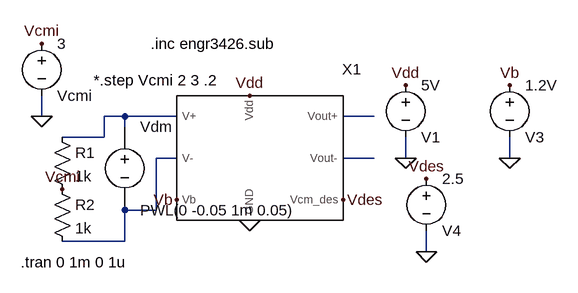
[diagram p0: schematic Draft1.asc]
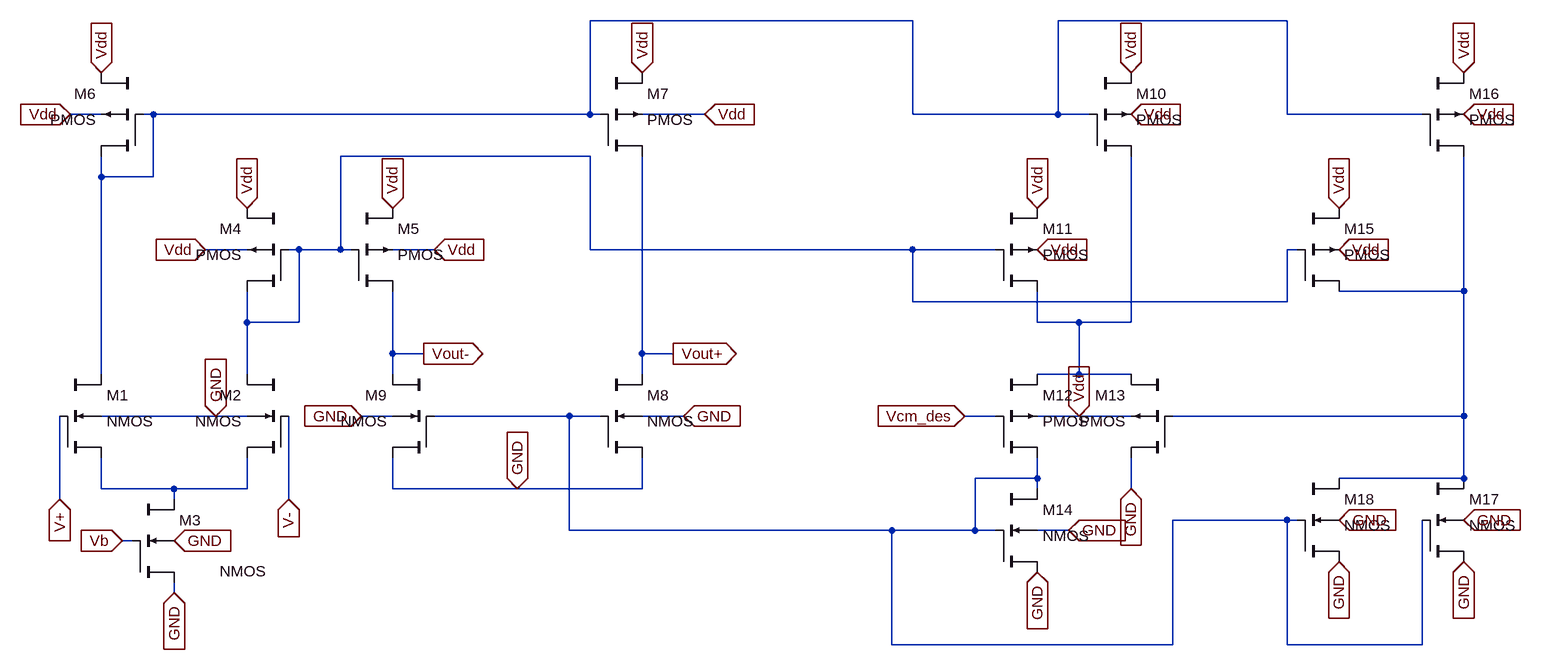
[diagram p1: sub-circuit cmfbdiffamp.asc]
Draft1.asc, the LTspice schematic file:
Version 4
SHEET 1 880 680
WIRE -176 112 -176 80
WIRE -48 112 -80 112
WIRE 32 112 -48 112
WIRE 336 112 288 112
WIRE -48 128 -48 112
WIRE -80 144 -80 112
WIRE -80 144 -144 144
WIRE 32 176 0 176
WIRE 336 176 288 176
WIRE 384 176 384 144
WIRE 544 176 544 144
WIRE 0 256 0 176
WIRE 0 256 -48 256
WIRE -48 304 -48 256
WIRE -48 304 -144 304
WIRE 416 320 416 288
FLAG 384 176 0
FLAG 384 64 Vdd
FLAG 544 64 Vb
FLAG 544 176 0
FLAG 144 80 Vdd
FLAG 144 272 0
FLAG 32 240 Vb
FLAG 416 320 0
FLAG 416 208 Vdes
FLAG 288 240 Vdes
FLAG -176 112 0
FLAG -176 0 Vcmi
FLAG -144 224 Vcmi
SYMBOL CMFBDiffAmp 144 176 R0
SYMATTR InstName X1
SYMBOL voltage 384 48 R0
WINDOW 0 24 96 Left 2
WINDOW 3 24 16 Left 2
WINDOW 123 0 0 Left 2
WINDOW 39 0 0 Left 2
SYMATTR InstName V1
SYMATTR Value 5V
SYMBOL voltage 544 48 R0
WINDOW 0 24 96 Left 2
WINDOW 3 24 16 Left 2
WINDOW 123 0 0 Left 2
WINDOW 39 0 0 Left 2
SYMATTR InstName V3
SYMATTR Value 1.2V
SYMBOL voltage 416 192 R0
WINDOW 0 24 96 Left 2
WINDOW 3 24 16 Left 2
WINDOW 123 0 0 Left 2
WINDOW 39 0 0 Left 2
SYMATTR InstName V4
SYMATTR Value 2.5
SYMBOL voltage -176 -16 R0
WINDOW 0 24 96 Left 2
WINDOW 3 24 16 Left 2
WINDOW 123 0 0 Left 2
WINDOW 39 0 0 Left 2
SYMATTR InstName Vcmi
SYMATTR Value 3
SYMBOL cktsym\\vsource -48 192 R0
WINDOW 39 0 0 Left 2
SYMATTR Value PWL(0 -0.05 1m 0.05)
SYMATTR InstName Vdm
SYMATTR Value2 AC 1 0
SYMBOL res -160 128 R0
SYMATTR InstName R1
SYMATTR Value 1k
SYMBOL res -160 208 R0
SYMATTR InstName R2
SYMATTR Value 1k
TEXT -208 336 Left 2 !.tran 0 1m 0 1u
TEXT -96 56 Left 2 !*.step Vcmi 2 3 .2
TEXT -8 0 Left 2 !.inc engr3426.sub

cmfbdiffamp.asc, the sub-circuit schematic file:
Version 4
SHEET 1 2344 680
WIRE 1376 -432 880 -432
WIRE 1952 -432 1600 -432
WIRE 128 -288 80 -288
WIRE 208 -288 192 -288
WIRE 880 -288 880 -432
WIRE 880 -288 208 -288
WIRE 896 -288 880 -288
WIRE 1056 -288 960 -288
WIRE 1376 -288 1376 -432
WIRE 1600 -288 1600 -432
WIRE 1600 -288 1376 -288
WIRE 1648 -288 1600 -288
WIRE 1952 -288 1952 -432
WIRE 2160 -288 1952 -288
WIRE 880 -224 496 -224
WIRE 128 -192 128 -224
WIRE 208 -192 208 -288
WIRE 208 -192 128 -192
WIRE 352 -80 288 -80
WIRE 432 -80 416 -80
WIRE 496 -80 496 -224
WIRE 496 -80 432 -80
WIRE 512 -80 496 -80
WIRE 640 -80 576 -80
WIRE 880 -80 880 -224
WIRE 1376 -80 880 -80
WIRE 1504 -80 1376 -80
WIRE 1968 -80 1952 -80
WIRE 2224 -16 2224 -224
WIRE 2224 -16 2032 -16
WIRE 1376 0 1376 -80
WIRE 1952 0 1952 -80
WIRE 1952 0 1376 0
WIRE 352 32 352 -16
WIRE 432 32 432 -80
WIRE 432 32 352 32
WIRE 1568 32 1568 -16
WIRE 1632 32 1568 32
WIRE 1712 32 1712 -224
WIRE 1712 32 1632 32
WIRE 576 80 576 -16
WIRE 624 80 576 80
WIRE 960 80 960 -224
WIRE 1008 80 960 80
WIRE 128 112 128 -192
WIRE 352 112 352 32
WIRE 576 112 576 80
WIRE 960 112 960 80
WIRE 1632 112 1632 32
WIRE 1632 112 1568 112
WIRE 1712 112 1632 112
WIRE 304 176 128 176
WIRE 352 176 304 176
WIRE 576 176 528 176
WIRE 848 176 640 176
WIRE 896 176 848 176
WIRE 1024 176 960 176
WIRE 1504 176 1456 176
WIRE 1632 176 1568 176
WIRE 1712 176 1632 176
WIRE 2224 176 2224 -16
WIRE 2224 176 1776 176
WIRE 1568 272 1568 240
WIRE 1568 272 1472 272
WIRE 2224 272 2224 176
WIRE 2224 272 2032 272
WIRE 128 288 128 240
WIRE 240 288 128 288
WIRE 352 288 352 240
WIRE 352 288 240 288
WIRE 576 288 576 240
WIRE 768 288 576 288
WIRE 960 288 960 240
WIRE 960 288 768 288
WIRE 1568 288 1568 272
WIRE 1712 288 1712 240
WIRE 64 304 64 176
WIRE 240 304 240 288
WIRE 416 304 416 176
WIRE 1952 336 1776 336
WIRE 1968 336 1952 336
WIRE 848 352 848 176
WIRE 1344 352 848 352
WIRE 1472 352 1472 272
WIRE 1472 352 1344 352
WIRE 1504 352 1472 352
WIRE 1616 352 1568 352
WIRE 176 368 160 368
WIRE 240 448 240 432
WIRE 1344 528 1344 352
WIRE 1776 528 1776 336
WIRE 1776 528 1344 528
WIRE 1952 528 1952 336
WIRE 2160 528 2160 336
WIRE 2160 528 1952 528
FLAG 128 -352 Vdd
IOPIN 128 -352 In
FLAG 352 -144 Vdd
IOPIN 352 -144 In
FLAG 576 -144 Vdd
IOPIN 576 -144 In
FLAG 960 -352 Vdd
IOPIN 960 -352 In
FLAG 80 -288 Vdd
IOPIN 80 -288 In
FLAG 288 -80 Vdd
IOPIN 288 -80 In
FLAG 640 -80 Vdd
IOPIN 640 -80 In
FLAG 1056 -288 Vdd
IOPIN 1056 -288 In
FLAG 304 176 GND
IOPIN 304 176 In
FLAG 240 368 GND
IOPIN 240 368 In
FLAG 528 176 GND
IOPIN 528 176 In
FLAG 1024 176 GND
IOPIN 1024 176 In
FLAG 160 368 Vb
IOPIN 160 368 In
FLAG 64 304 V+
IOPIN 64 304 In
FLAG 416 304 V-
IOPIN 416 304 In
FLAG 1568 -80 Vdd
IOPIN 1568 -80 In
FLAG 1712 -288 Vdd
IOPIN 1712 -288 In
FLAG 1712 288 GND
IOPIN 1712 288 In
FLAG 1616 352 GND
IOPIN 1616 352 In
FLAG 1568 -144 Vdd
IOPIN 1568 -144 In
FLAG 1712 -352 Vdd
IOPIN 1712 -352 In
FLAG 2224 -352 Vdd
IOPIN 2224 -352 In
FLAG 2224 -288 Vdd
IOPIN 2224 -288 In
FLAG 2032 -144 Vdd
IOPIN 2032 -144 In
FLAG 2032 -80 Vdd
IOPIN 2032 -80 In
FLAG 2032 336 GND
IOPIN 2032 336 In
FLAG 2224 336 GND
IOPIN 2224 336 In
FLAG 2224 400 GND
IOPIN 2224 400 In
FLAG 2032 400 GND
IOPIN 2032 400 In
FLAG 1568 416 GND
IOPIN 1568 416 In
FLAG 624 80 Vout-
IOPIN 624 80 Out
FLAG 1008 80 Vout+
IOPIN 1008 80 Out
FLAG 1456 176 Vcm_des
IOPIN 1456 176 In
FLAG 1632 176 Vdd
IOPIN 1632 176 In
FLAG 240 448 GND
IOPIN 240 448 In
FLAG 768 288 GND
IOPIN 768 288 In
SYMBOL cktsym\\nmos4 128 176 R0
SYMATTR InstName M1
SYMATTR Value2 l=1.8um w=1.8um
SYMBOL cktsym\\nmos4 352 176 M0
SYMATTR InstName M2
SYMATTR Value2 l=1.8um w=1.8um
SYMBOL cktsym\\nmos4 240 368 R0
WINDOW 3 70 47 Left 2
SYMATTR InstName M3
SYMATTR Value2 l=1.8um w=1.8um
SYMBOL cktsym\\pmos4 352 -80 M0
SYMATTR InstName M4
SYMATTR Value2 l=1.8um w=1.8um
SYMBOL cktsym\\pmos4 576 -80 R0
SYMATTR InstName M5
SYMATTR Value2 l=1.8um w=1.8um
SYMBOL cktsym\\pmos4 128 -288 M0
SYMATTR InstName M6
SYMATTR Value2 l=1.8um w=1.8um
SYMBOL cktsym\\pmos4 960 -288 R0
SYMATTR InstName M7
SYMATTR Value2 l=1.8um w=1.8um
SYMBOL cktsym\\nmos4 960 176 R0
SYMATTR InstName M8
SYMATTR Value2 l=1.8um w=1.8um
SYMBOL cktsym\\nmos4 576 176 M0
SYMATTR InstName M9
SYMATTR Value2 l=1.8um w=1.8um
SYMBOL cktsym\\pmos4 1712 -288 R0
SYMATTR InstName M10
SYMATTR Value2 l=1.8um w=1.8um
SYMBOL cktsym\\pmos4 1568 -80 R0
SYMATTR InstName M11
SYMATTR Value2 l=1.8um w=1.8um
SYMBOL cktsym\\pmos4 1568 176 R0
SYMATTR InstName M12
SYMATTR Value2 l=1.8um w=1.8um
SYMBOL cktsym\\pmos4 1712 176 M0
SYMATTR InstName M13
SYMATTR Value2 l=1.8um w=1.8um
SYMBOL cktsym\\nmos4 1568 352 R0
SYMATTR InstName M14
SYMATTR Value2 l=1.8um w=1.8um
SYMBOL cktsym\\pmos4 2032 -80 R0
SYMATTR InstName M15
SYMATTR Value2 l=1.8um w=1.8um
SYMBOL cktsym\\pmos4 2224 -288 R0
SYMATTR InstName M16
SYMATTR Value2 l=1.8um w=1.8um
SYMBOL cktsym\\nmos4 2224 336 R0
SYMATTR InstName M17
SYMATTR Value2 l=1.8um w=1.8um
SYMBOL cktsym\\nmos4 2032 336 R0
SYMATTR InstName M18
SYMATTR Value2 l=1.8um w=1.8um

The netlist it stands for:
* Draft1.asc
XX1 0 N001 N003 Vb Vdd Vdes N002 N004 cmfbdiffamp
V1 Vdd 0 5V
V3 Vb 0 1.2V
V4 Vdes 0 2.5
Vcmi Vcmi 0 3
Vdm N001 N003 PWL(0 -0.05 1m 0.05) AC 1 0
R1 N001 Vcmi 1k
R2 Vcmi N003 1k

* block symbol definitions
.subckt cmfbdiffamp GND V+ V- Vb Vdd Vcm_des Vout+ Vout-
M1 N001 V+ N006 GND NMOS l=1.8um w=1.8um
M2 N002 V- N006 GND NMOS l=1.8um w=1.8um
M3 N006 Vb GND GND NMOS l=1.8um w=1.8um
M4 N002 N002 Vdd Vdd PMOS l=1.8um w=1.8um
M5 Vout- N002 Vdd Vdd PMOS l=1.8um w=1.8um
M6 N001 N001 Vdd Vdd PMOS l=1.8um w=1.8um
M7 Vout+ N001 Vdd Vdd PMOS l=1.8um w=1.8um
M8 Vout+ N005 GND GND NMOS l=1.8um w=1.8um
M9 Vout- N005 GND GND NMOS l=1.8um w=1.8um
M10 N004 N001 Vdd Vdd PMOS l=1.8um w=1.8um
M11 N004 N002 Vdd Vdd PMOS l=1.8um w=1.8um
M12 N005 Vcm_des N004 Vdd PMOS l=1.8um w=1.8um
M13 GND N003 N004 Vdd PMOS l=1.8um w=1.8um
M14 N005 N005 GND GND NMOS l=1.8um w=1.8um
M15 N003 N002 Vdd Vdd PMOS l=1.8um w=1.8um
M16 N003 N001 Vdd Vdd PMOS l=1.8um w=1.8um
M17 N003 N005 GND GND NMOS l=1.8um w=1.8um
M18 N003 N005 GND GND NMOS l=1.8um w=1.8um
.ends cmfbdiffamp

.model NMOS NMOS
.model PMOS PMOS
.lib standard.mos
.tran 0 1m 0 1u
*.step Vcmi 2 3 .2
.inc engr3426.sub
.backanno
.end